# Altium schematic sheet Capstone.SchDoc
size B
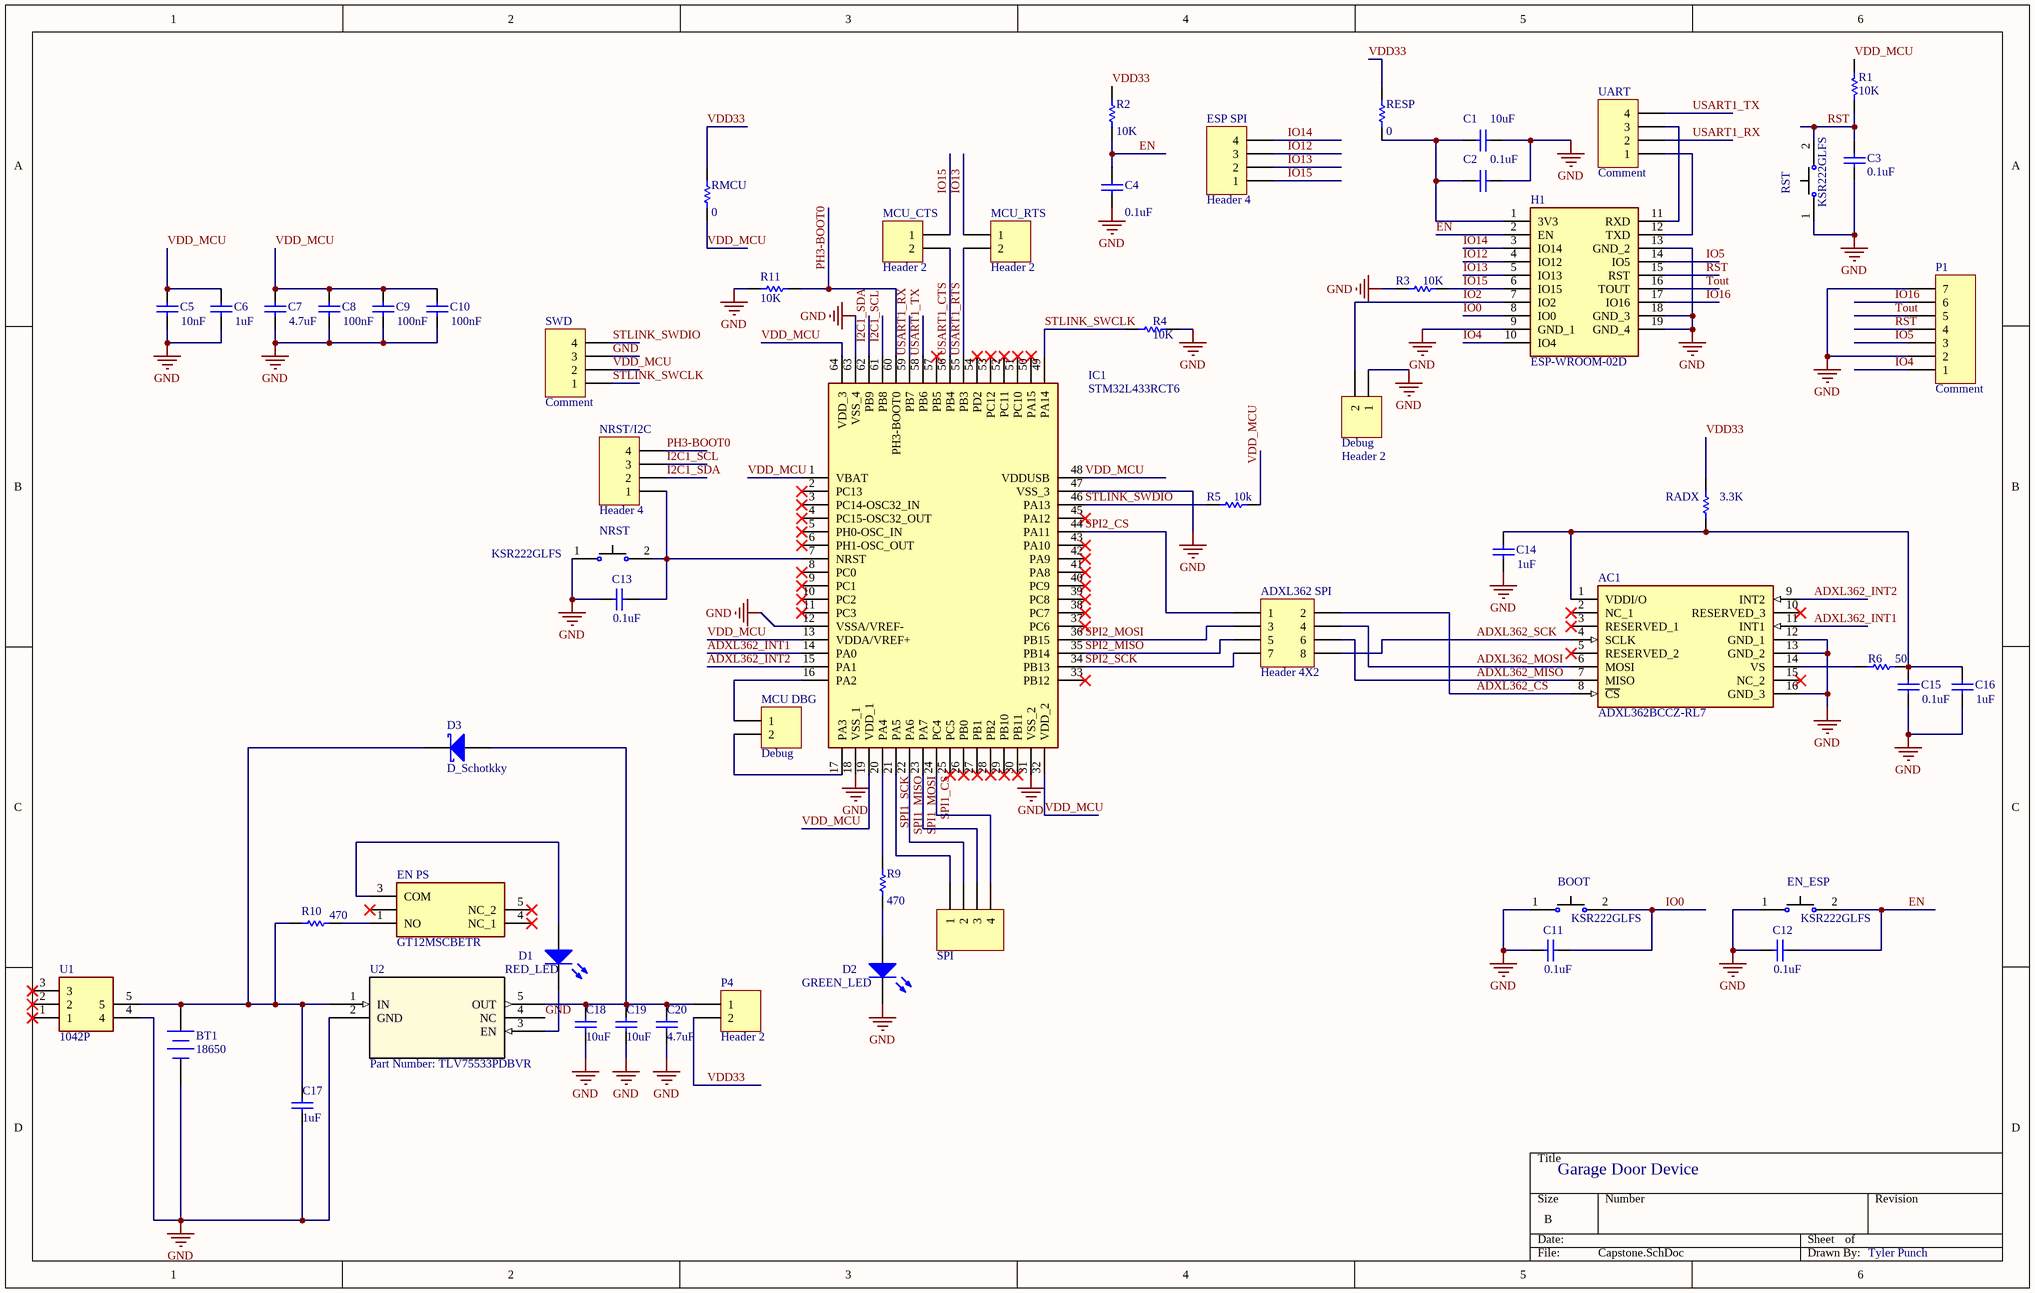
[diagram p0: Capstone.SchDoc]

## Parts
AC1  ADXL362BCCZ-RL7  [CC-16-4]
ADXL362_SPI  Header 4X2  [HDR2X4]
BOOT  KSR222GLFS  [*SW_KSR223GLFG]
BT1  18650  [BAT-2]
C1  value 10uF  [*CAPC2012X88N]  (hidden comment: Cap)
C2  value 0.1uF  [*CAPC2012X88N]  (hidden comment: Cap)
C3  value 0.1uF  [*CAPC2012X88N]  (hidden comment: Cap)
C4  value 0.1uF  [*CAPC2012X88N]  (hidden comment: Cap)
C5  value 10nF  [*CAPC2012X88N]  (hidden comment: Cap)
C6  value 1uF  [*CAPC2012X88N]  (hidden comment: Cap)
C7  value 4.7uF  [*CAPC2012X88N]  (hidden comment: Cap)
C8  value 100nF  [*CAPC2012X88N]  (hidden comment: Cap)
C9  value 100nF  [*CAPC2012X88N]  (hidden comment: Cap)
C10  value 100nF  [*CAPC2012X88N]  (hidden comment: Cap)
C11  value 0.1uF  [*CAPC2012X88N]  (hidden comment: Cap)
C12  value 0.1uF  [*CAPC2012X88N]  (hidden comment: Cap)
C13  value 0.1uF  [*CAPC2012X88N]  (hidden comment: Cap)
C14  value 1uF  [*CAPC2012X88N]  (hidden comment: Cap)
C15  value 0.1uF  [*CAPC2012X88N]  (hidden comment: Cap)
C16  value 1uF  [*CAPC2012X88N]  (hidden comment: Cap)
C17  value 1uF  [*CAPC2012X88N]  (hidden comment: Cap)
C18  value 10uF  [0402]  (hidden comment: Cap)
C19  value 10uF  [0402]  (hidden comment: Cap)
C20  value 4.7uF  [0402]  (hidden comment: Cap)
D1  RED_LED  [0402]
D2  GREEN_LED  [0402]
D3  D_Schotkky  [SD0805]
Debug  Header 2  [HDR1X2]
EN_ESP  KSR222GLFS  [*SW_KSR223GLFG]
EN_PS  GT12MSCBETR  [GT11MSCBE]
ESP_SPI  Header 4  [HDR1X4]
H1  ESP-WROOM-02D  [ESPWROOM02D]
IC1  STM32L433RCT6  [QFP50P1200X1200X160-64N]
MCU_CTS  Header 2  [HDR1X2]
MCU_DBG  Debug  [HDR1X2]
MCU_RTS  Header 2  [HDR1X2]
NRST  KSR222GLFS  [*SW_KSR223GLFG]
NRST/I2C  Header 4  [HDR1X4]
P1  Comment  [HDR1X7]
P4  Header 2  [HDR1X2]
R1  value 10K  [6-0805_N]  (hidden comment: Res1)
R2  value 10K  [6-0805_N]  (hidden comment: Res1)
R3  value 10K  [6-0805_N]  (hidden comment: Res1)
R4  value 10K  [6-0805_N]  (hidden comment: Res1)
R5  value 10k  [6-0805_N]  (hidden comment: Res1)
R6  value 50  [RES_WSC_2515]  (hidden comment: Res1)
R9  value 470  [6-0805_N]  (hidden comment: Res1)
R10  value 470  [6-0805_N]  (hidden comment: Res1)
R11  value 10K  [6-0805_N]  (hidden comment: Res1)
RADX  3.3K  [6-0805_N]
RESP  value 0  [6-0805_N]
RMCU  value 0  [6-0805_N]  (hidden comment: Res1)
RST  KSR222GLFS  [*SW_KSR223GLFG]
SPI  (no value)  [HDR1X4]
SWD  Comment  [HDR1X4]
U1  1042P  [1042P]
U2  Part Number: TLV75533PDBVR  [DBV5]
UART  Comment  [HDR1X4]

## Nets
GND: AC1.12(GND_1) AC1.13(GND_2) AC1.16(GND_3) BOOT.1 BT1.2(-) C1.2 C2.2 C3.2 C4.2 C5.1 C6.1 C7.1 C8.1 C9.1 C10.1 C11.1 C12.1 C13.1 C14.2 C15.1 C16.2 C17.1 C18.1 C19.1 C20.1 D2.2(K) Debug.1 EN_ESP.1 H1.9(GND_1) H1.13(GND_2) H1.18(GND_3) H1.19(GND_4) IC1.12(VSSA/VREF-) IC1.18(VSS_1) IC1.31(VSS_2) IC1.47(VSS_3) IC1.63(VSS_4) NRST.1 P1.2 P1.7 R3.1 R4.2 R11.2 RST.1 SWD.3 U1.4 U2.2(GND) U2.4(NC)
ADXL362_CS: AC1.8(~{CS}) ADXL362_SPI.2
ADXL362_INT1: AC1.11(INT1) IC1.14(PA0)
ADXL362_INT2: AC1.9(INT2) IC1.15(PA1)
ADXL362_MISO: AC1.7(MISO) ADXL362_SPI.6
ADXL362_MOSI: AC1.6(MOSI) ADXL362_SPI.4
ADXL362_SCK: AC1.4(SCLK) ADXL362_SPI.8
EN: C4.1 C12.2 EN_ESP.2 H1.2(EN) R2.2
I2C1_SCL: IC1.61(PB8) NRST/I2C.3
I2C1_SDA: IC1.62(PB9) NRST/I2C.2
IO0: BOOT.2 C11.2 H1.8(IO0)
IO2: Debug.2 H1.7(IO2)
IO4: H1.10(IO4) P1.1
IO5: H1.14(IO5) P1.3
IO12: ESP_SPI.3 H1.4(IO12)
IO13: ESP_SPI.2 H1.5(IO13) MCU_RTS.1
IO14: ESP_SPI.4 H1.3(IO14)
IO15: ESP_SPI.1 H1.6(IO15) MCU_CTS.1 R3.2
IO16: H1.17(IO16) P1.6
PH3-BOOT0: IC1.60(PH3-BOOT0) NRST/I2C.4 R11.1
RST: C3.1 H1.15(RST) P1.4 R1.2 RST.2
SPI1_CS: IC1.24(PC4) SPI.4
SPI1_MISO: IC1.22(PA6) SPI.2
SPI1_MOSI: IC1.23(PA7) SPI.3
SPI1_SCK: IC1.21(PA5) SPI.1
SPI2_CS: ADXL362_SPI.1 IC1.44(PA11)
SPI2_MISO: ADXL362_SPI.5 IC1.35(PB14)
SPI2_MOSI: ADXL362_SPI.3 IC1.36(PB15)
SPI2_SCK: ADXL362_SPI.7 IC1.34(PB13)
STLINK_SWCLK: IC1.49(PA14) R4.1 SWD.1
STLINK_SWDIO: IC1.46(PA13) R5.1 SWD.4
Tout: H1.16(TOUT) P1.5
USART1_CTS: IC1.56(PB4) MCU_CTS.2
USART1_RTS: IC1.55(PB3) MCU_RTS.2
USART1_RX: IC1.59(PB7) UART.2
USART1_TX: IC1.58(PB6) UART.4
VDD33: P4.2 R2.1 RADX.2 RESP.2 RMCU.2
VDD_MCU: C5.2 C6.2 C7.2 C8.2 C9.2 C10.2 IC1.1(VBAT) IC1.13(VDDA/VREF+) IC1.19(VDD_1) IC1.32(VDD_2) IC1.48(VDDUSB) IC1.64(VDD_3) R1.1 R5.2 RMCU.1 SWD.2
NetAC1_1: AC1.1(VDDI/O) C14.1 C15.2 C16.1 R6.2 RADX.1
NetAC1_14: AC1.14(VS) R6.1
NetBT1_1: BT1.1(+) C17.2 D3.2(K) R10.1 U1.5 U2.1(IN)
NetC1_1: C1.1 C2.1 H1.1(3V3) RESP.1
NetC13_2: C13.2 IC1.7(NRST) NRST.2 NRST/I2C.1
NetC18_2: C18.2 C19.2 C20.2 D3.1(A) P4.1 U2.5(OUT)
NetD1_1: D1.1(A) EN_PS.3(COM)
NetD1_2: D1.2(K) U2.3(EN)
NetD2_1: D2.1(A) R9.1
NetEN_PS_1: EN_PS.1(NO) R10.2
NetH1_11: H1.11(RXD) UART.3
NetH1_12: H1.12(TXD) UART.1
NetIC1_16: IC1.16(PA2) MCU_DBG.1
NetIC1_17: IC1.17(PA3) MCU_DBG.2
NetIC1_20: IC1.20(PA4) R9.2

Not connected (* = marked no-connect by the designer): AC1 2(NC_1)* 3(RESERVED_1)* 5(RESERVED_2)* 10(RESERVED_3)* 15(NC_2)*; EN_PS 2(NO_PIN)* 4(NC_1)* 5(NC_2)*; IC1 2(PC13)* 3(PC14-OSC32_IN)* 4(PC15-OSC32_OUT)* 5(PH0-OSC_IN)* 6(PH1-OSC_OUT)* 8(PC0)* 9(PC1)* 10(PC2)* 11(PC3)* 25(PC5)* 26(PB0)* 27(PB1)* 28(PB2)* 29(PB10)* 30(PB11)* 33(PB12)* 37(PC6)* 38(PC7)* 39(PC8)* 40(PC9)* 41(PA8)* 42(PA9)* 43(PA10)* 45(PA12)* 50(PA15)* 51(PC10)* 52(PC11)* 53(PC12)* 54(PD2)* 57(PB5)*; U1 1* 2* 3*

## Notes on the sheet
- Garage Door Device
- Tyler Punch

## Library data of the parts
AC1 = ADXL362BCCZ-RL7: Accelerometer; Manufacturer_Name: Analog Devices; Datasheet Link: http://www.analog.com/media/en/technical-documentation/data-sheets/ADXL362.pdf; Manufacturer_Part_Number: ADXL362BCCZ-RL7; Mouser Part Number: 584-ADXL362BCCZ-R7; Mouser Price/Stock: https://www.mouser.com/Search/Refine.aspx?Keyword=584-ADXL362BCCZ-R7
ADXL362_SPI = Header 4X2: Header, 4-Pin, Dual row; LatestRevisionDate: 17-Jul-2002; LatestRevisionNote: Re-released for DXP Platform.; Publisher: Altium Limited
BOOT EN_ESP NRST RST = KSR223GLFG: Switch Tactile N.O. SPST Round Button Gull Wing 0.01A 32VDC 0.2VA 200000Cycles 2N SMD Automotive T/R; MF: C&K; Package: None; Digi-Key_Purchase_URL: https://www.digikey.com/product-detail/en/c-k/KSR223GLFG/401-1704-1-ND/958078?utm_source=snapeda&utm_medium=aggregator&utm_campaign=symbol; SnapEDA_Link: https://www.snapeda.com/parts/KSR223GLFG/C%26K/view-part/?ref=snap; MP: KSR223GLFG; Digi-Key_Part_Number: 401-1704-1-ND; Value: *
BT1 = Battery: Multicell Battery; Published: 24-Mar-1999; LatestRevisionDate: 17-Jul-2002; LatestRevisionNote: Re-released for DXP Platform.; PackageReference: BAT-2; Publisher: Altium Limited; PackageDescription: Battery; 2 Leads
C1-C20 = Cap: Capacitor; Published: 8-Jun-2000; LatestRevisionDate: 17-Jul-2002; LatestRevisionNote: Re-released for DXP Platform.; PackageReference: RAD-0.3; Publisher: Altium Limited; PackageDescription: Radial Cap, Thru-Hole; 2 Leads; 0.3 in Pin Spacing
D1 D2 = LED3: Typical BLUE SiC LED; Published: 8-Jun-2000; LatestRevisionDate: 17-Dec-2003; LatestRevisionNote: PCB Footprint replaced.; DatasheetVersion: 16-Apr-2002; PackageVersion: 16-Apr-2002; PackageReference: 3.5X2.8X1.9; Publisher: Altium Limited; PackageDescription: SM LED; 2 C-Bend Leads; Body 3.5 x 2.8 x 1.9 mm, inc leads (LxWxH typ)
D3 = D Schottky: Schottky Diode; Published: 8-Jun-2000; LatestRevisionDate: 17-Jul-2002; LatestRevisionNote: Re-released for DXP Platform.; PackageReference: SMB; Publisher: Altium Limited; PackageDescription: DO-214-AA/SMB; 2 C-Bend Leads; Body 5.3 x 3.6 mm, inc. leads (LxW); Code_JEDEC: DO-214-AA
Debug MCU_CTS MCU_DBG MCU_RTS P4 = Header 2: Header, 2-Pin; LatestRevisionDate: 17-Jul-2002; LatestRevisionNote: Re-released for DXP Platform.; Publisher: Altium Limited
EN_PS = GT12MSCBETR: Switch; Manufacturer_Name: C & K COMPONENTS; Datasheet Link: https://componentsearchengine.com/Datasheets/1/GT12MSCBETR.pdf; Mouser Part Number: 611-GT12MSCBETR; Mouser Price/Stock: https://www.mouser.com/Search/Refine.aspx?Keyword=611-GT12MSCBETR; Manufacturer_Part_Number: GT12MSCBETR
ESP_SPI NRST/I2C SPI SWD UART = Header 4: Header, 4-Pin; LatestRevisionDate: 17-Jul-2002; LatestRevisionNote: Re-released for DXP Platform.; Publisher: Altium Limited
H1 = ESP-WROOM-02D: Hardware; Manufacturer_Name: Espressif; Datasheet Link: https://br.mouser.com/datasheet/2/891/esp-wroom-02d_esp-wroom-02u_datasheet_en-1365835.pdf; Height: 3.2mm; Manufacturer_Part_Number: ESP-WROOM-02D; Mouser Part Number: 356-ESPWROOM-02D
IC1 = STM32L433RCT6: Integrated Circuit; Manufacturer_Name: STMicroelectronics; Datasheet Link: https://www.st.com/resource/en/datasheet/stm32l433rc.pdf; Height: 1.6mm; Manufacturer_Part_Number: STM32L433RCT6; Mouser Part Number: 511-STM32L433RCT6; Mouser Price/Stock: https://www.mouser.com/Search/Refine.aspx?Keyword=511-STM32L433RCT6
P1 = Header 7: Header, 7-Pin; LatestRevisionDate: 17-Jul-2002; LatestRevisionNote: Re-released for DXP Platform.; Publisher: Altium Limited
R1-R6 R9-R11 RADX RESP RMCU = Res1: Resistor; Published: 8-Jun-2000; LatestRevisionDate: 17-Jul-2002; LatestRevisionNote: Re-released for DXP Platform.; PackageReference: AXIAL-0.3; Publisher: Altium Limited; PackageDescription: Axial Device, Thru-Hole; 2 Leads; 0.3 in Pin Spacing
  RADX: Value: 3.3K
U1 = 1042P: Undefined or Miscellaneous; Manufacturer_Name: Keystone Electronics; Allied_Number: 71135189; Datasheet Link: http://www.keyelco.com/product-pdf.cfm?p=13957; Height: 14mm; Manufacturer_Part_Number: 1042P; Mouser Part Number: 534-1042P; Mouser Price/Stock: https://www.mouser.com/Search/Refine.aspx?Keyword=534-1042P; Allied Price/Stock: https://www.alliedelec.com/keystone-electronics-1042p/71135189/
U2 = TLV75533PDBVR: No Description Available; Vendor: Texas Instruments; Manufacturer_Part_Number: TLV75533PDBVR; Copyright: Copyright (C) 2018 Accelerated Designs. All rights reserved; RefDes: RefDes; Type: DEV; Value: Value